# EasyEDA schematic SCH_HOME-AUTOMATION_2025-03-31.json

## Sheets
1 Sheet_1: TITLE: Sheet_1; REV: 1.0; Date: 2025-03-24; Sheet: 1/1; Drawn By: HARISH.G.L; Company: Your Company
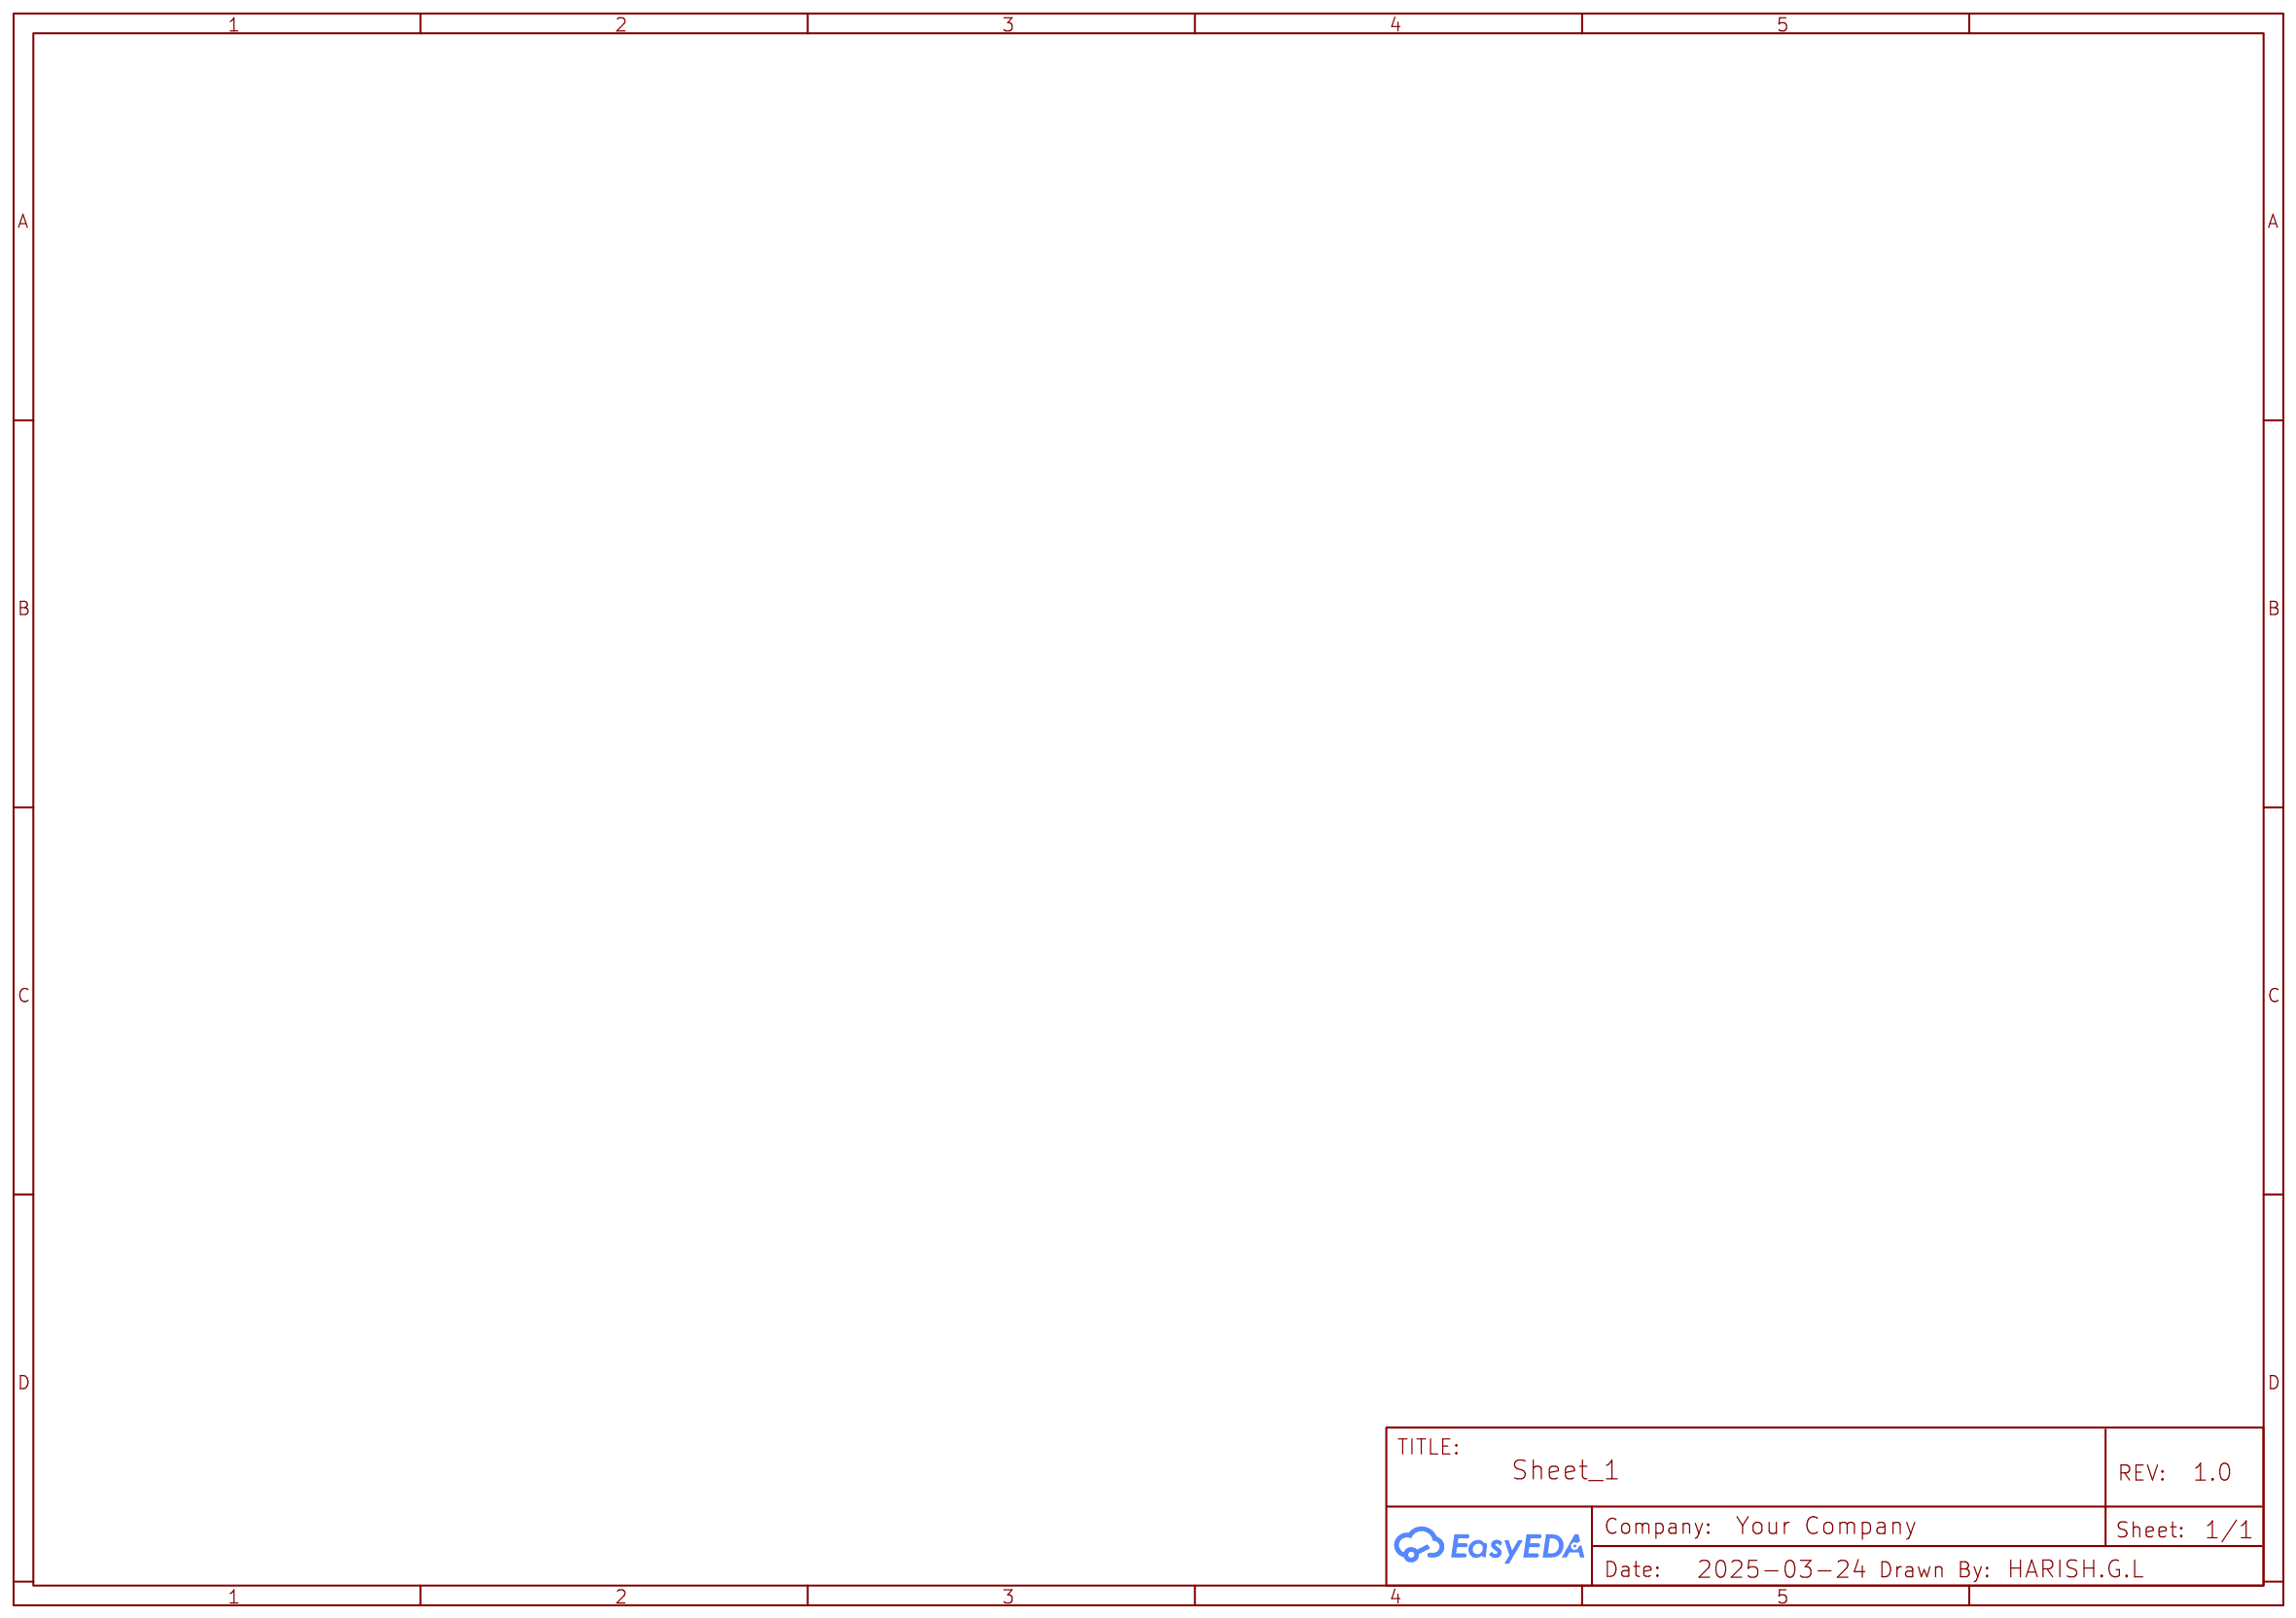
[diagram p0: Sheet_1]
2 ASTRO: TITLE: ASTRO; Date: 2025-03-30; Drawn By: HARISH GL
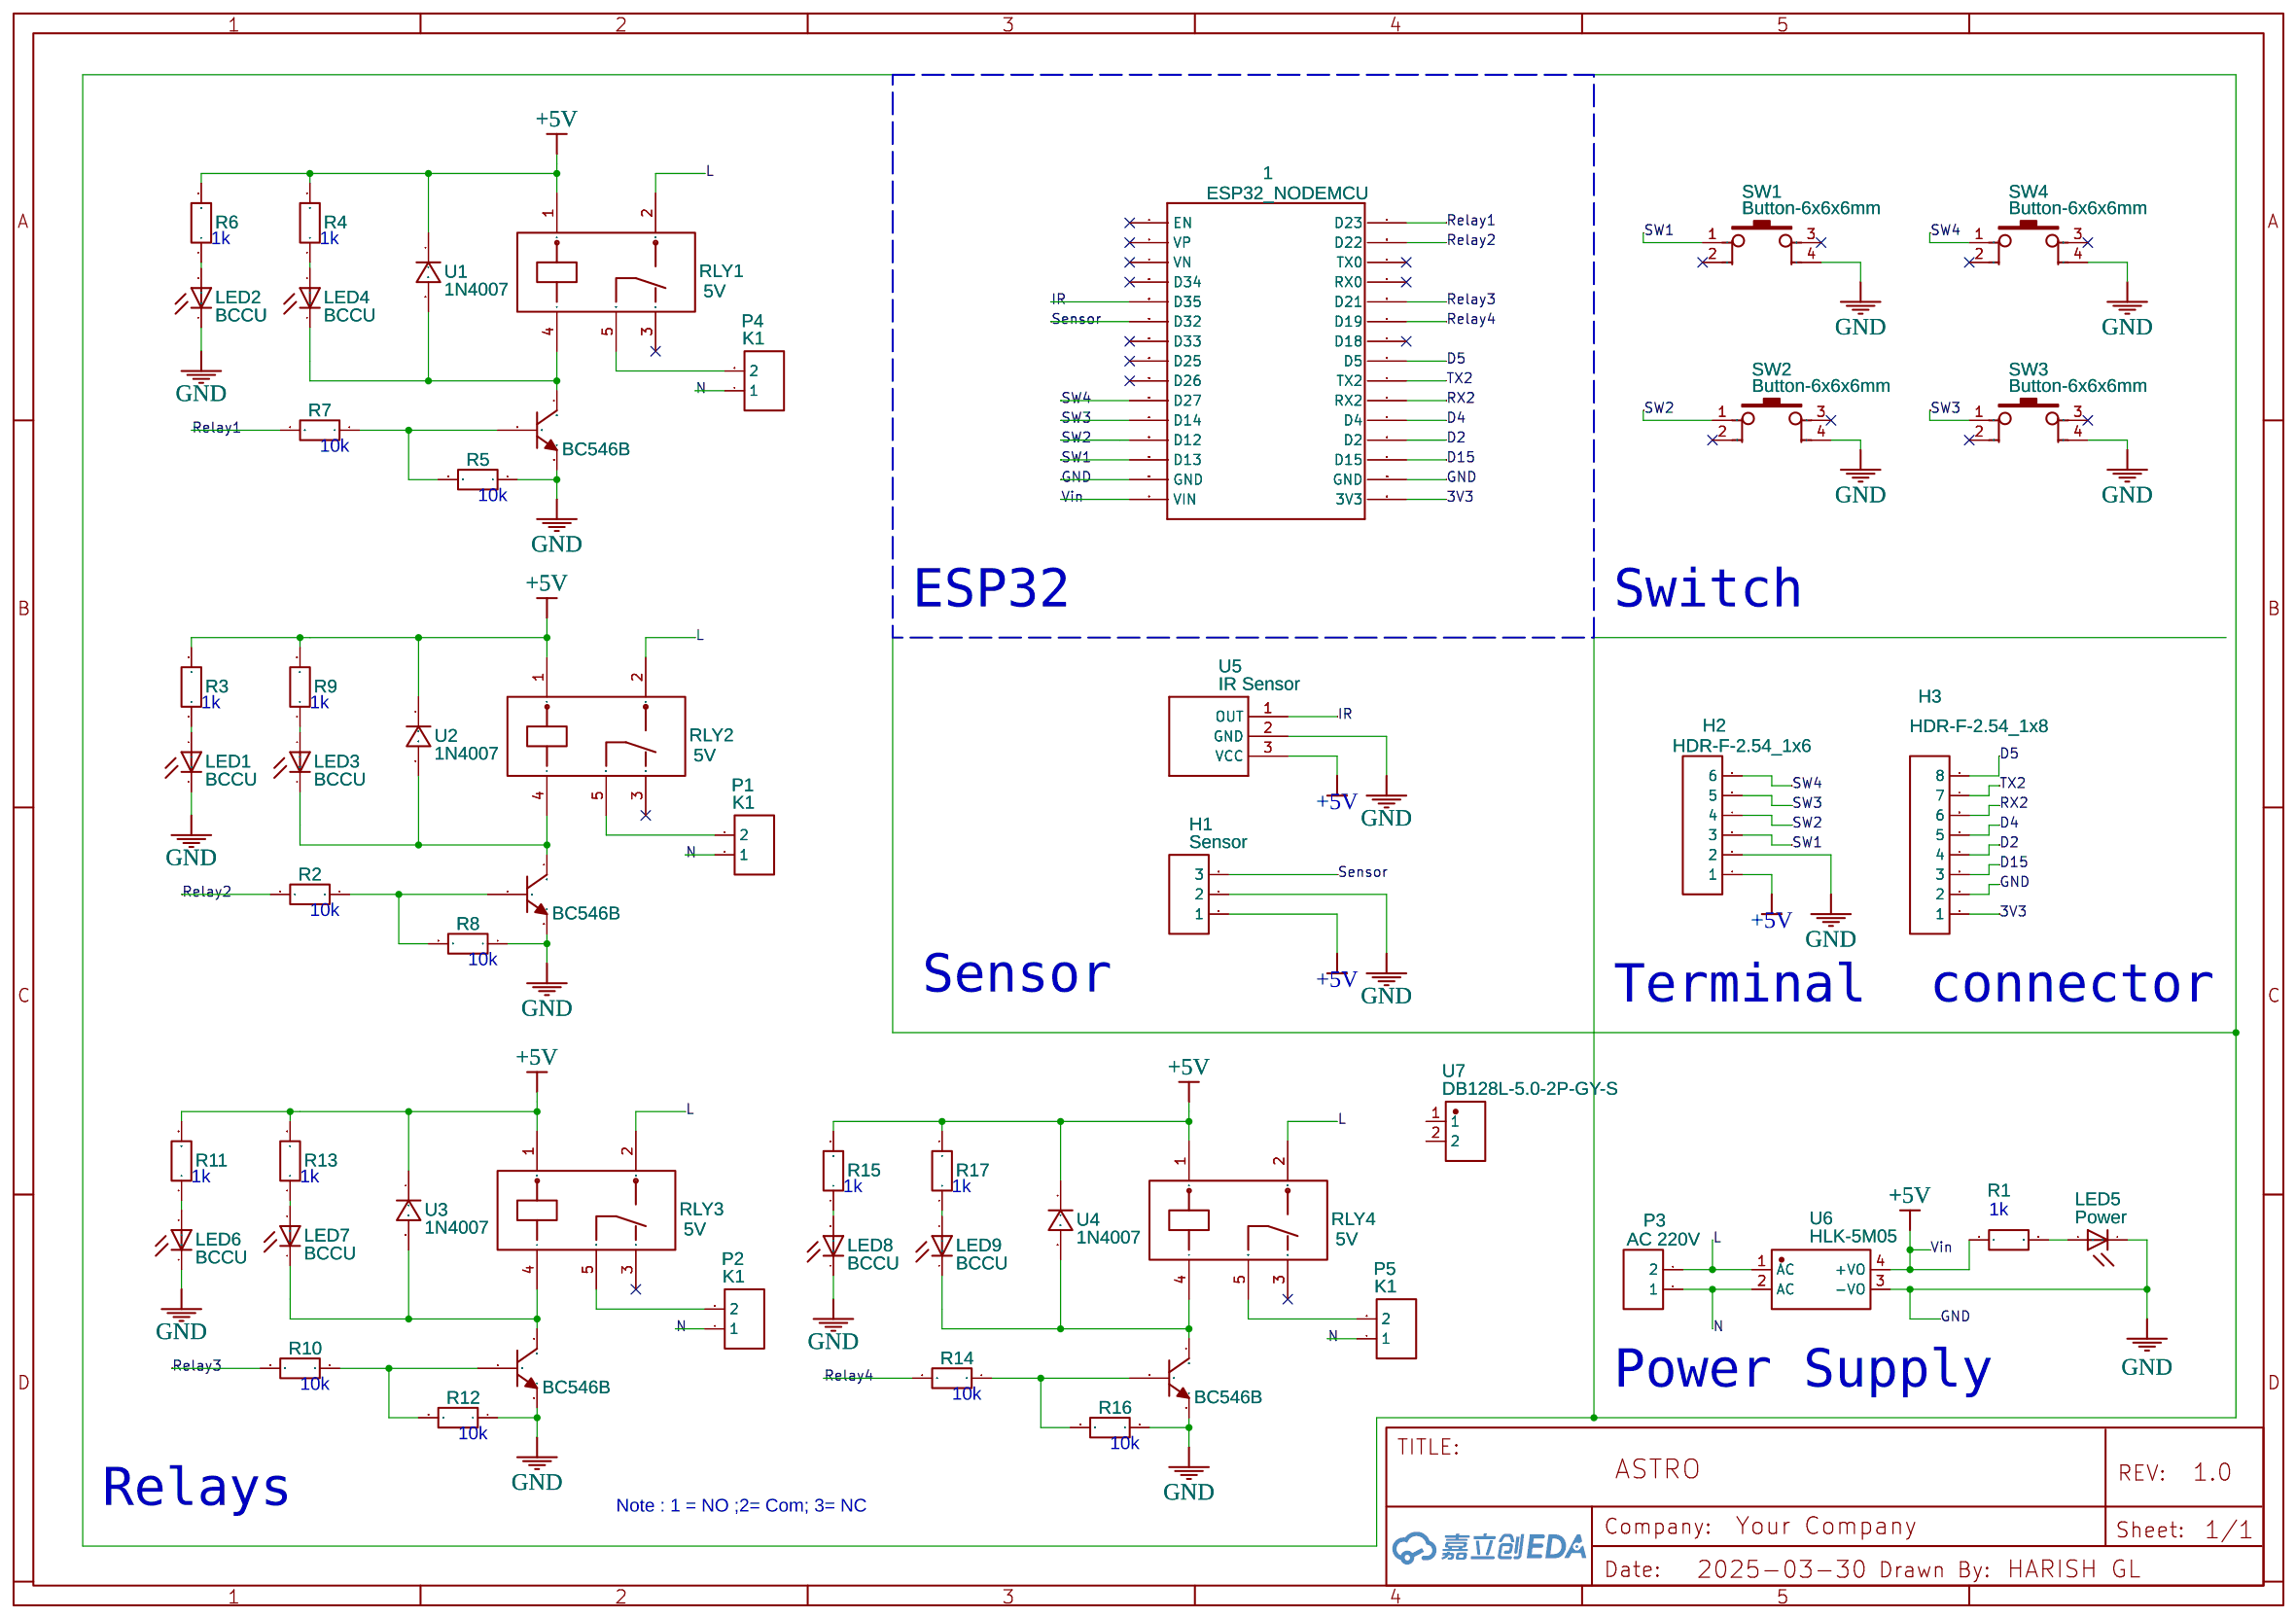
[diagram p1: ASTRO]

## Parts
1  ESP32_NODEMCU  [EPS32_NODEMCU_SHIELD_NOHOLES]
C1  BC546B  [BC547]
C2  BC546B  [BC547]
C3  BC546B  [BC547]
C4  BC546B  [BC547]
H1  Sensor  [HDR-F-2.54_1X3]
H2  HDR-F-2.54_1x6  [HDR-F-2.54_1X6]
H3  HDR-F-2.54_1x8  [HDR-F-2.54_1X8]
LED1  BCCU  [LED_LED5MM]
LED2  BCCU  [LED_LED5MM]
LED3  BCCU  [LED_LED5MM]
LED4  BCCU  [LED_LED5MM]
LED5  Power  [LED_LED5MM]
LED6  BCCU  [LED_LED5MM]
LED7  BCCU  [LED_LED5MM]
LED8  BCCU  [LED_LED5MM]
LED9  BCCU  [LED_LED5MM]
P1  K1  [CONN-TH_2P-P5.00]
P2  K1  [CONN-TH_2P-P5.00]
P3  AC 220V  [CONN-TH_2P-P5.00]
P4  K1  [CONN-TH_2P-P5.00]
P5  K1  [CONN-TH_2P-P5.00]
R1  RESISTOR1/4W COPY COPY  [RESISTOR1/4W]
R2  RESISTOR1/4W COPY COPY  [RESISTOR1/4W]
R3  RESISTOR1/4W COPY COPY  [RESISTOR1/4W]
R4  RESISTOR1/4W COPY COPY  [RESISTOR1/4W]
R5  RESISTOR1/4W COPY COPY  [RESISTOR1/4W]
R6  RESISTOR1/4W COPY COPY  [RESISTOR1/4W]
R7  RESISTOR1/4W COPY COPY  [RESISTOR1/4W]
R8  RESISTOR1/4W COPY COPY  [RESISTOR1/4W]
R9  RESISTOR1/4W COPY COPY  [RESISTOR1/4W]
R10  RESISTOR1/4W COPY COPY  [RESISTOR1/4W]
R11  RESISTOR1/4W COPY COPY  [RESISTOR1/4W]
R12  RESISTOR1/4W COPY COPY  [RESISTOR1/4W]
R13  RESISTOR1/4W COPY COPY  [RESISTOR1/4W]
R14  RESISTOR1/4W COPY COPY  [RESISTOR1/4W]
R15  RESISTOR1/4W COPY COPY  [RESISTOR1/4W]
R16  RESISTOR1/4W COPY COPY  [RESISTOR1/4W]
R17  RESISTOR1/4W COPY COPY  [RESISTOR1/4W]
RLY1  5V  [RELAY-TH_SRD-XXVDC-XL-C]
RLY2  5V  [RELAY-TH_SRD-XXVDC-XL-C]
RLY3  5V  [RELAY-TH_SRD-XXVDC-XL-C]
RLY4  5V  [RELAY-TH_SRD-XXVDC-XL-C]
SW1  Button-6x6x6mm  [SW-TH_4PIN-L6.00-W6.00]
SW2  Button-6x6x6mm  [SW-TH_4PIN-L6.00-W6.00]
SW3  Button-6x6x6mm  [SW-TH_4PIN-L6.00-W6.00]
SW4  Button-6x6x6mm  [SW-TH_4PIN-L6.00-W6.00]
U1  1N4007  [1N4007_FP]
U2  1N4007  [1N4007_FP]
U3  1N4007  [1N4007_FP]
U4  1N4007  [1N4007_FP]
U5  IR Sensor  [BRM-2508]
U6  HLK-5M05  [PWRM-TH_HLK-5M05]
U7  DB128L-5.0-2P-GY-S  [CONN-TH_2P-P5.00_DB128L-5.0-2P-GY-S]

## Library data of the parts
1 = ESP32_NODEMCU_SHIELDESP32_NODEMCU_SHIELD_NOHOLES COPY: Contributor: PhilipEasyEDA
C1-C4 = BC546B: Contributor: R.M.Venkatraj
H1 = HDR-F-2.54_1x3: Supplier Part: C146690; Supplier: LCSC; Contributor: LCEDA_Lib
H2 = HDR-F-2.54_1x6: Supplier Part: C40877; Supplier: LCSC; Contributor: LCEDA_Lib
H3 = HDR-F-2.54_1x8: Supplier Part: C225505; Supplier: LCSC; Contributor: LCEDA_Lib
LED1-LED9 = LED_LED5MM COPY2 COPY COPY: LED; Contributor: asifafridi
P1-P5 = CONN-TH_2P-P5.00: Supplier: LCSC; Contributor: LCEDA_Lib
R1-R17 = RESISTOR1/4W COPY COPY: Contributor: Davetech
RLY1-RLY4 = SRD-05VDC-SL-C: Supplier: LCSC; Manufacturer: SONGLE; Supplier Part: C35449; JLCPCB Part Class: Extended Part
SW1-SW4 = Button-6x6x6mm: Supplier Part: C71836; Supplier: LCSC; Manufacturer: BBJ; Manufacturer Part: Switch,6*6*6Plastic head,260G, 0.25mm,Straight line
U1-U4 = 1N4007_SB: Contributor: nikola.stq
U5 = BRM-2A18RA: BRM-2A18 IR receiver.; Contributor: SparkFun
U6 = HLK-5M05: Supplier: LCSC; Supplier Part: C209907; Manufacturer: HI-LINK(海凌科); Contributor: LCSC; JLCPCB Part Class: Extended Part
U7 = DB128L-5.0-2P-GY-S: Contributor: LCSC; Supplier: LCSC; Supplier Part: C430598; Manufacturer: DIBO(地博电气); JLCPCB Part Class: Extended Part; link: https://lcsc.com/eda_search?q=C430598&%26type=1&ref=editor

## Nets
3V3: 1.3V3 H3.1
+5V: 1.VIN H1.1 H2.1 R1.1 R3.2 R4.2 R6.2 R9.2 R11.2 R13.2 R15.2 R17.2 RLY1.1 RLY2.1 RLY3.1 RLY4.1 U1.1 U2.1 U3.1 U4.1 U5.3(VCC) U6.4(+VO)
GND: 1.GND@1(GND) 1.GND@2(GND) C1.3(E) C2.3(E) C3.3(E) C4.3(E) H1.2 H2.2 H3.2 LED1.K(C) LED2.K(C) LED5.K(C) LED6.K(C) LED8.K(C) R5.1 R8.1 R12.1 R16.1 SW1.4 SW2.4 SW3.4 SW4.4 U5.2(GND) U6.3(-VO)
D2: 1.D2 H3.4
D4: 1.D4 H3.5
D5: 1.D5 H3.8
D15: 1.D15 H3.3
IR: 1.D35 U5.1(OUT)
L: P3.2 RLY1.2 RLY2.2 RLY3.2 RLY4.2 U6.1(AC)
N: P1.1 P2.1 P3.1 P4.1 P5.1 U6.2(AC)
Relay1: 1.D23 R7.2
Relay2: 1.D22 R2.2
Relay3: 1.D21 R10.2
Relay4: 1.D19 R14.2
RX2: 1.RX2 H3.6
Sensor: 1.D32 H1.3
SW1: 1.D13 H2.3 SW1.1
SW2: 1.D12 H2.4 SW2.1
SW3: 1.D14 H2.5 SW3.1
SW4: 1.D27 H2.6 SW4.1
TX2: 1.TX2 H3.7
Net-(C1-1): C1.1(C) LED4.K(C) RLY1.4 U1.2
Net-(C1-2): C1.2(B) R5.2 R7.1
Net-(C2-1): C2.1(C) LED3.K(C) RLY2.4 U2.2
Net-(C2-2): C2.2(B) R2.1 R8.2
Net-(C3-1): C3.1(C) LED7.K(C) RLY3.4 U3.2
Net-(C3-2): C3.2(B) R10.1 R12.2
Net-(C4-1): C4.1(C) LED9.K(C) RLY4.4 U4.2
Net-(C4-2): C4.2(B) R14.1 R16.2
Net-(LED1-A): LED1.A R3.1
Net-(LED2-A): LED2.A R6.1
Net-(LED3-A): LED3.A R9.1
Net-(LED4-A): LED4.A R4.1
Net-(LED5-A): LED5.A R1.2
Net-(LED6-A): LED6.A R11.1
Net-(LED7-A): LED7.A R13.1
Net-(LED8-A): LED8.A R15.1
Net-(LED9-A): LED9.A R17.1
Net-(P1-2): P1.2 RLY2.5
Net-(P2-2): P2.2 RLY3.5
Net-(P4-2): P4.2 RLY1.5
Net-(P5-2): P5.2 RLY4.5

Not connected (* = marked no-connect by the designer): 1 D18* D25* D26* D33* D34* EN* RX0* TX0* VN* VP*; RLY1 3*; RLY2 3*; RLY3 3*; RLY4 3*; SW1 2* 3*; SW2 2* 3*; SW3 2* 3*; SW4 2* 3*; U7 1 2

## Notes on the sheets
sheet 2
- 1k
- 1k
- 10k
- 10k
- ESP32
- Switch
- 1k
- 1k
- 10k
- 10k
- Sensor
- Terminal  connector
- 1k
- 1k
- 1k
- 1k
- 1k
- Power Supply
- 10k
- 10k
- 10k
- 10k
- Relays
- Note : 1 = NO ;2= Com; 3= NC
